# Altium schematic sheet Main.SchDoc
size A3; SheetNumber: 1; SheetTotal: 10
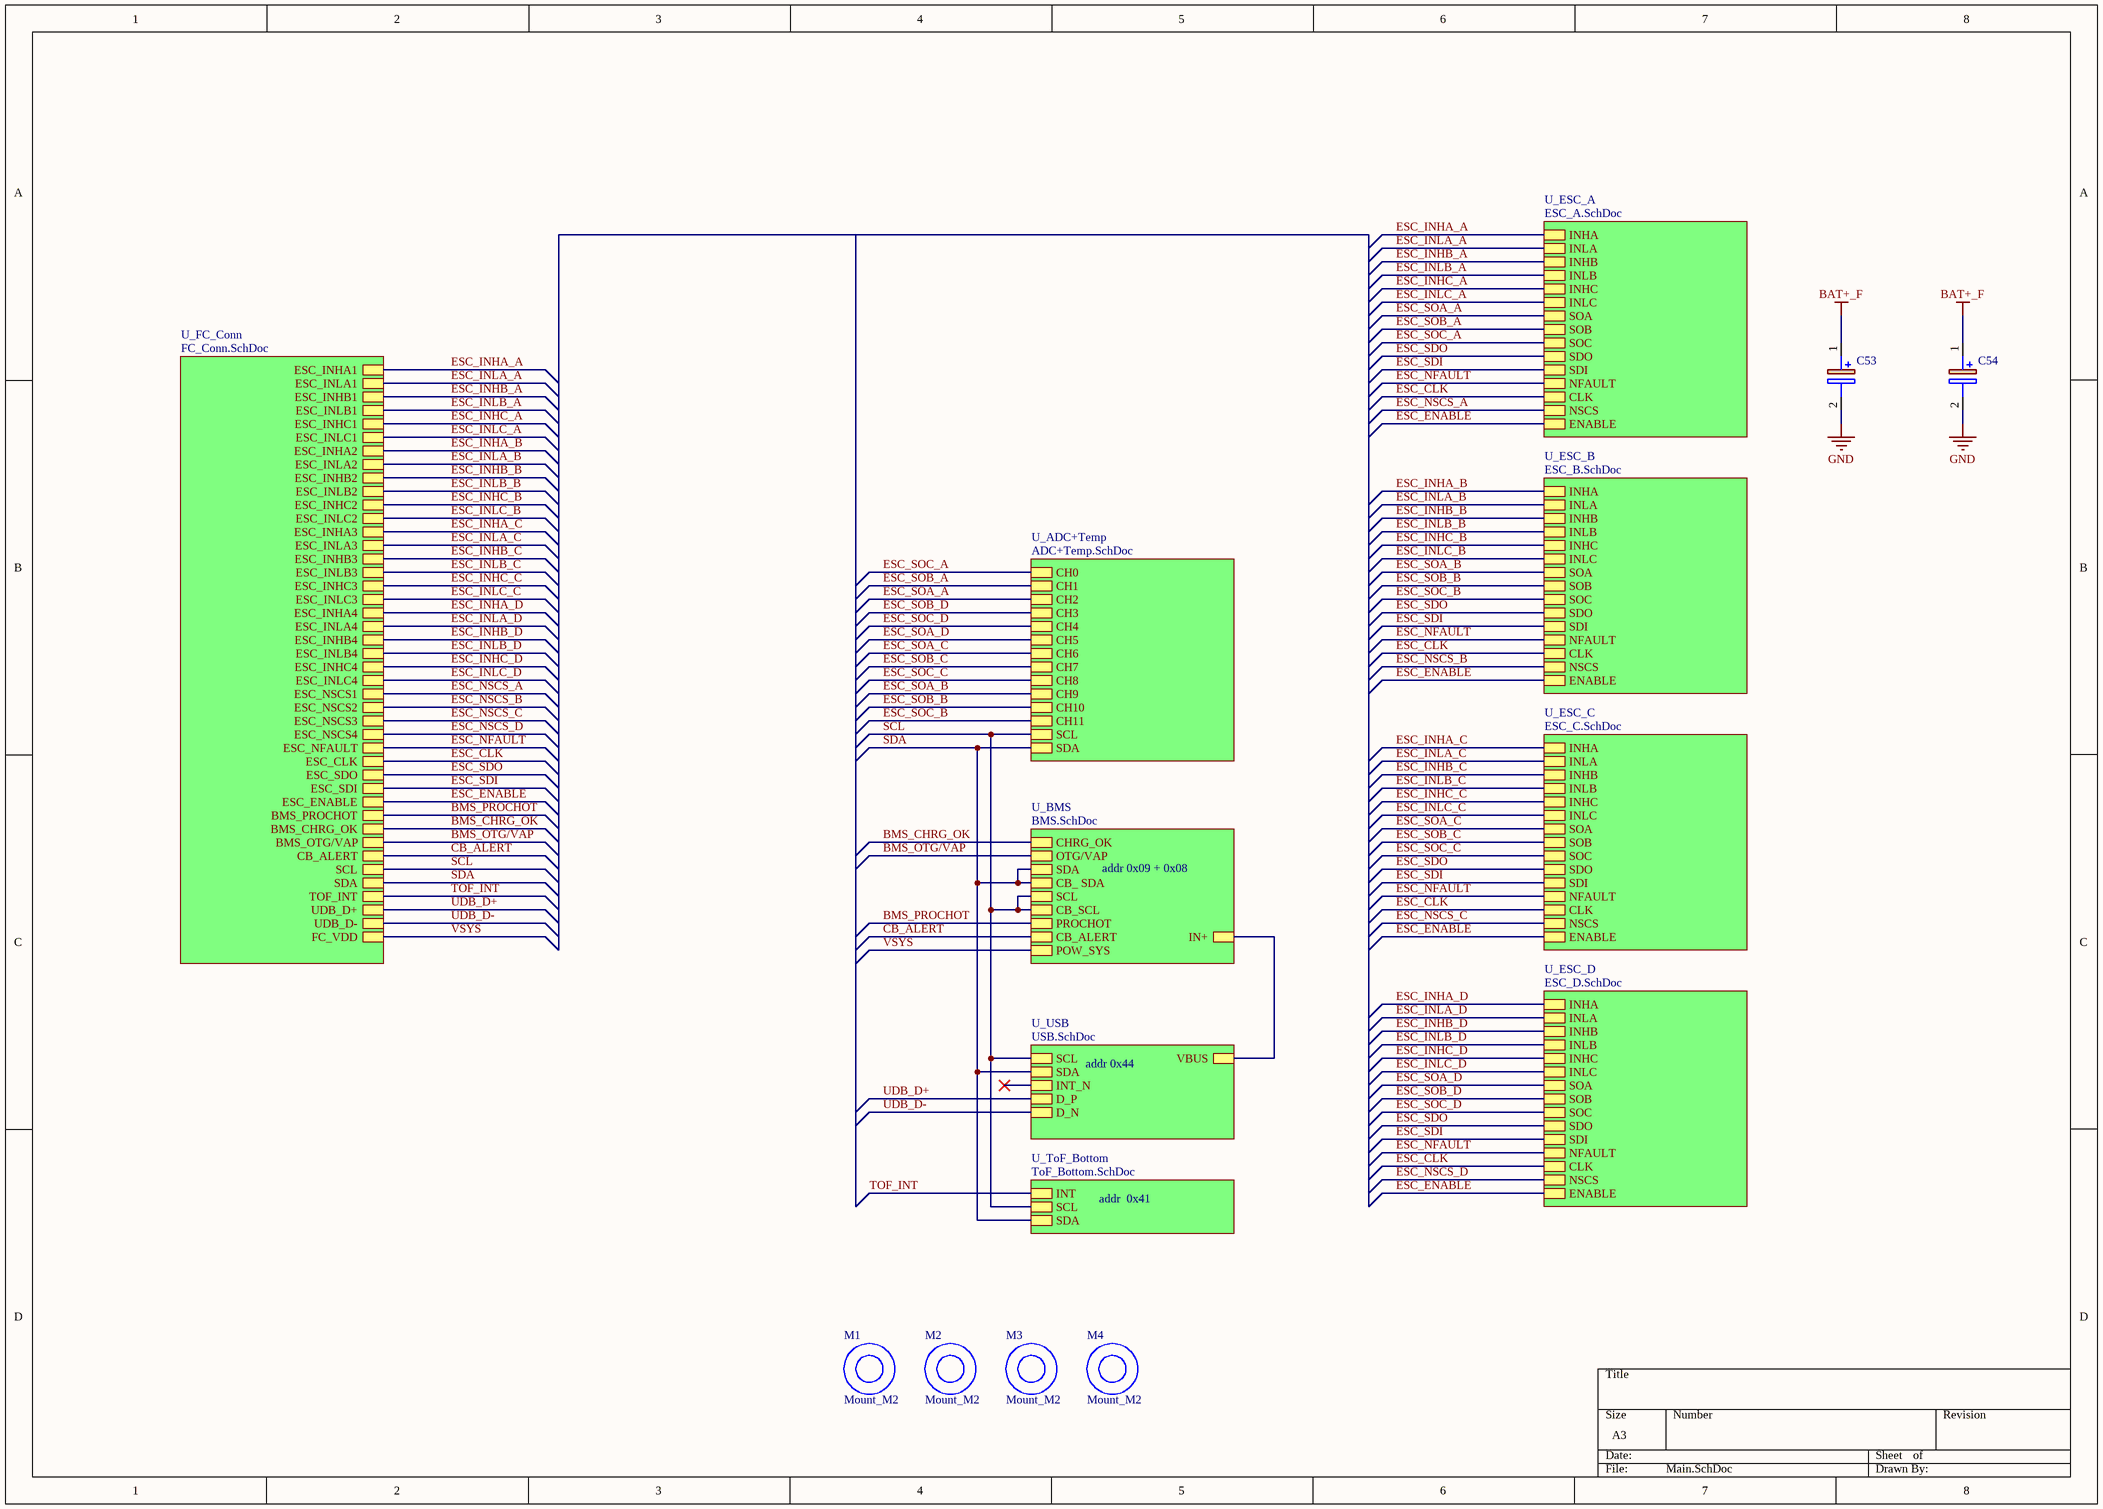
[diagram p0: Main.SchDoc]

## Parts
C53  EEH-ZL1V151XP  [EEEHP1H4R7P]  (value not drawn)
C54  EEH-ZL1V151XP  [EEEHP1H4R7P]  (value not drawn)
M1  Mount_M2  [Mount_M2]
M2  Mount_M2  [Mount_M2]
M3  Mount_M2  [Mount_M2]
M4  Mount_M2  [Mount_M2]

## Sub-sheets
U_ADC+Temp = ADC+Temp.SchDoc: SDA, SCL, CH0, CH1, CH2, CH3, CH4, CH5, CH6, CH7, CH8, CH9, CH10, CH11
U_BMS = BMS.SchDoc: CHRG_OK, OTG/VAP, SDA, SCL, PROCHOT, CB_SCL, CB_ SDA, CB_ALERT, POW_SYS, IN+
U_ESC_A = ESC_A.SchDoc: INHA, INLA, INHB, INLB, INHC, INLC, SOA, SOB, SOC, SDO, SDI, NFAULT, CLK, NSCS, ENABLE
U_ESC_B = ESC_B.SchDoc: INHA, INLA, INHB, INLB, INHC, INLC, SOA, SOB, SOC, SDO, SDI, NFAULT, CLK, NSCS, ENABLE
U_ESC_C = ESC_C.SchDoc: INHA, INLA, INHB, INLB, INHC, INLC, SOA, SOB, SOC, SDO, SDI, NFAULT, CLK, NSCS, ENABLE
U_ESC_D = ESC_D.SchDoc: INHA, INLA, INHB, INLB, INHC, INLC, SOA, SOB, SOC, SDO, SDI, NFAULT, CLK, NSCS, ENABLE
U_FC_Conn = FC_Conn.SchDoc: ESC_INLA1, ESC_INLB1, ESC_INLC1, ESC_INLA2, ESC_INLB2, ESC_INLC2, ESC_INLA3, ESC_INLB3, ESC_INLC3, ESC_INHA4, ESC_INLB4, ESC_INLC4, ESC_NSCS1, ESC_INHA1, ESC_INHB1, ESC_INHC1, ESC_INHA2, ESC_INHB2, ESC_INHC2, ESC_INHA3, ESC_INHB3, ESC_INHC3, ESC_INLA4, ESC_INHB4, ESC_INHC4, ESC_NSCS2, ESC_NSCS3, ESC_NSCS4, ESC_NFAULT, ESC_CLK, ESC_SDO, ESC_SDI, ESC_ENABLE, BMS_PROCHOT, BMS_CHRG_OK, BMS_OTG/VAP, CB_ALERT, SCL, SDA, TOF_INT, UDB_D+, UDB_D-, FC_VDD
U_ToF_Bottom = ToF_Bottom.SchDoc: INT, SCL, SDA
U_USB = USB.SchDoc: SCL, SDA, INT_N, D_P, D_N, VBUS

## Nets
BAT+_F: C53.1(+) C54.1(+)
GND: C53.2(-) C54.2(-)
BMS_CHRG_OK: sheet U_BMS/CHRG_OK, sheet U_FC_Conn/BMS_CHRG_OK
BMS_OTG/VAP: sheet U_BMS/OTG/VAP, sheet U_FC_Conn/BMS_OTG/VAP
BMS_PROCHOT: sheet U_BMS/PROCHOT, sheet U_FC_Conn/BMS_PROCHOT
CB_ALERT: sheet U_BMS/CB_ALERT, sheet U_FC_Conn/CB_ALERT
ESC_CLK: sheet U_FC_Conn/ESC_CLK, sheet U_ESC_A/CLK, sheet U_ESC_B/CLK, sheet U_ESC_C/CLK, sheet U_ESC_D/CLK
ESC_ENABLE: sheet U_FC_Conn/ESC_ENABLE, sheet U_ESC_A/ENABLE, sheet U_ESC_B/ENABLE, sheet U_ESC_C/ENABLE, sheet U_ESC_D/ENABLE
ESC_INHA_A: sheet U_FC_Conn/ESC_INHA1, sheet U_ESC_A/INHA
ESC_INHA_B: sheet U_FC_Conn/ESC_INHA2, sheet U_ESC_B/INHA
ESC_INHA_C: sheet U_FC_Conn/ESC_INHA3, sheet U_ESC_C/INHA
ESC_INHA_D: sheet U_FC_Conn/ESC_INHA4, sheet U_ESC_D/INHA
ESC_INHB_A: sheet U_FC_Conn/ESC_INHB1, sheet U_ESC_A/INHB
ESC_INHB_B: sheet U_FC_Conn/ESC_INHB2, sheet U_ESC_B/INHB
ESC_INHB_C: sheet U_FC_Conn/ESC_INHB3, sheet U_ESC_C/INHB
ESC_INHB_D: sheet U_FC_Conn/ESC_INHB4, sheet U_ESC_D/INHB
ESC_INHC_A: sheet U_FC_Conn/ESC_INHC1, sheet U_ESC_A/INHC
ESC_INHC_B: sheet U_FC_Conn/ESC_INHC2, sheet U_ESC_B/INHC
ESC_INHC_C: sheet U_FC_Conn/ESC_INHC3, sheet U_ESC_C/INHC
ESC_INHC_D: sheet U_FC_Conn/ESC_INHC4, sheet U_ESC_D/INHC
ESC_INLA_A: sheet U_FC_Conn/ESC_INLA1, sheet U_ESC_A/INLA
ESC_INLA_B: sheet U_FC_Conn/ESC_INLA2, sheet U_ESC_B/INLA
ESC_INLA_C: sheet U_FC_Conn/ESC_INLA3, sheet U_ESC_C/INLA
ESC_INLA_D: sheet U_FC_Conn/ESC_INLA4, sheet U_ESC_D/INLA
ESC_INLB_A: sheet U_FC_Conn/ESC_INLB1, sheet U_ESC_A/INLB
ESC_INLB_B: sheet U_FC_Conn/ESC_INLB2, sheet U_ESC_B/INLB
ESC_INLB_C: sheet U_FC_Conn/ESC_INLB3, sheet U_ESC_C/INLB
ESC_INLB_D: sheet U_FC_Conn/ESC_INLB4, sheet U_ESC_D/INLB
ESC_INLC_A: sheet U_FC_Conn/ESC_INLC1, sheet U_ESC_A/INLC
ESC_INLC_B: sheet U_FC_Conn/ESC_INLC2, sheet U_ESC_B/INLC
ESC_INLC_C: sheet U_FC_Conn/ESC_INLC3, sheet U_ESC_C/INLC
ESC_INLC_D: sheet U_FC_Conn/ESC_INLC4, sheet U_ESC_D/INLC
ESC_NFAULT: sheet U_FC_Conn/ESC_NFAULT, sheet U_ESC_A/NFAULT, sheet U_ESC_B/NFAULT, sheet U_ESC_C/NFAULT, sheet U_ESC_D/NFAULT
ESC_NSCS_A: sheet U_FC_Conn/ESC_NSCS1, sheet U_ESC_A/NSCS
ESC_NSCS_B: sheet U_FC_Conn/ESC_NSCS2, sheet U_ESC_B/NSCS
ESC_NSCS_C: sheet U_FC_Conn/ESC_NSCS3, sheet U_ESC_C/NSCS
ESC_NSCS_D: sheet U_FC_Conn/ESC_NSCS4, sheet U_ESC_D/NSCS
ESC_SDI: sheet U_FC_Conn/ESC_SDI, sheet U_ESC_A/SDI, sheet U_ESC_B/SDI, sheet U_ESC_C/SDI, sheet U_ESC_D/SDI
ESC_SDO: sheet U_FC_Conn/ESC_SDO, sheet U_ESC_A/SDO, sheet U_ESC_B/SDO, sheet U_ESC_C/SDO, sheet U_ESC_D/SDO
ESC_SOA_A: sheet U_ADC+Temp/CH2, sheet U_ESC_A/SOA
ESC_SOA_B: sheet U_ADC+Temp/CH9, sheet U_ESC_B/SOA
ESC_SOA_C: sheet U_ADC+Temp/CH6, sheet U_ESC_C/SOA
ESC_SOA_D: sheet U_ADC+Temp/CH5, sheet U_ESC_D/SOA
ESC_SOB_A: sheet U_ADC+Temp/CH1, sheet U_ESC_A/SOB
ESC_SOB_B: sheet U_ADC+Temp/CH10, sheet U_ESC_B/SOB
ESC_SOB_C: sheet U_ADC+Temp/CH7, sheet U_ESC_C/SOB
ESC_SOB_D: sheet U_ADC+Temp/CH3, sheet U_ESC_D/SOB
ESC_SOC_A: sheet U_ADC+Temp/CH0, sheet U_ESC_A/SOC
ESC_SOC_B: sheet U_ADC+Temp/CH11, sheet U_ESC_B/SOC
ESC_SOC_C: sheet U_ADC+Temp/CH8, sheet U_ESC_C/SOC
ESC_SOC_D: sheet U_ADC+Temp/CH4, sheet U_ESC_D/SOC
SCL: sheet U_BMS/SCL, sheet U_BMS/CB_SCL, sheet U_USB/SCL, sheet U_ADC+Temp/SCL, sheet U_ToF_Bottom/SCL, sheet U_FC_Conn/SCL
SDA: sheet U_BMS/SDA, sheet U_BMS/CB_ SDA, sheet U_USB/SDA, sheet U_ADC+Temp/SDA, sheet U_ToF_Bottom/SDA, sheet U_FC_Conn/SDA
TOF_INT: sheet U_ToF_Bottom/INT, sheet U_FC_Conn/TOF_INT
UDB_D+: sheet U_USB/D_P, sheet U_FC_Conn/UDB_D+
UDB_D-: sheet U_USB/D_N, sheet U_FC_Conn/UDB_D-
VSYS: sheet U_BMS/POW_SYS, sheet U_FC_Conn/FC_VDD
(unnamed): sheet U_BMS/IN+, sheet U_USB/VBUS

## Notes on the sheet
- addr 0x09 + 0x08
- addr 0x44
- addr  0x41

## Library data of the parts
C53 C54 = EEH-ZL1V151XP: Capacitor Polarised; Manufacturer_Name: Panasonic; Datasheet Link: https://industrial.panasonic.com/cdbs/www-data/pdf/RDD0000/ast-ind-303928.pdf; Manufacturer_Part_Number: EEH-ZL1V151XP